# EAGLE schematic FishShield_v2 (EAGLE 7.5.0)
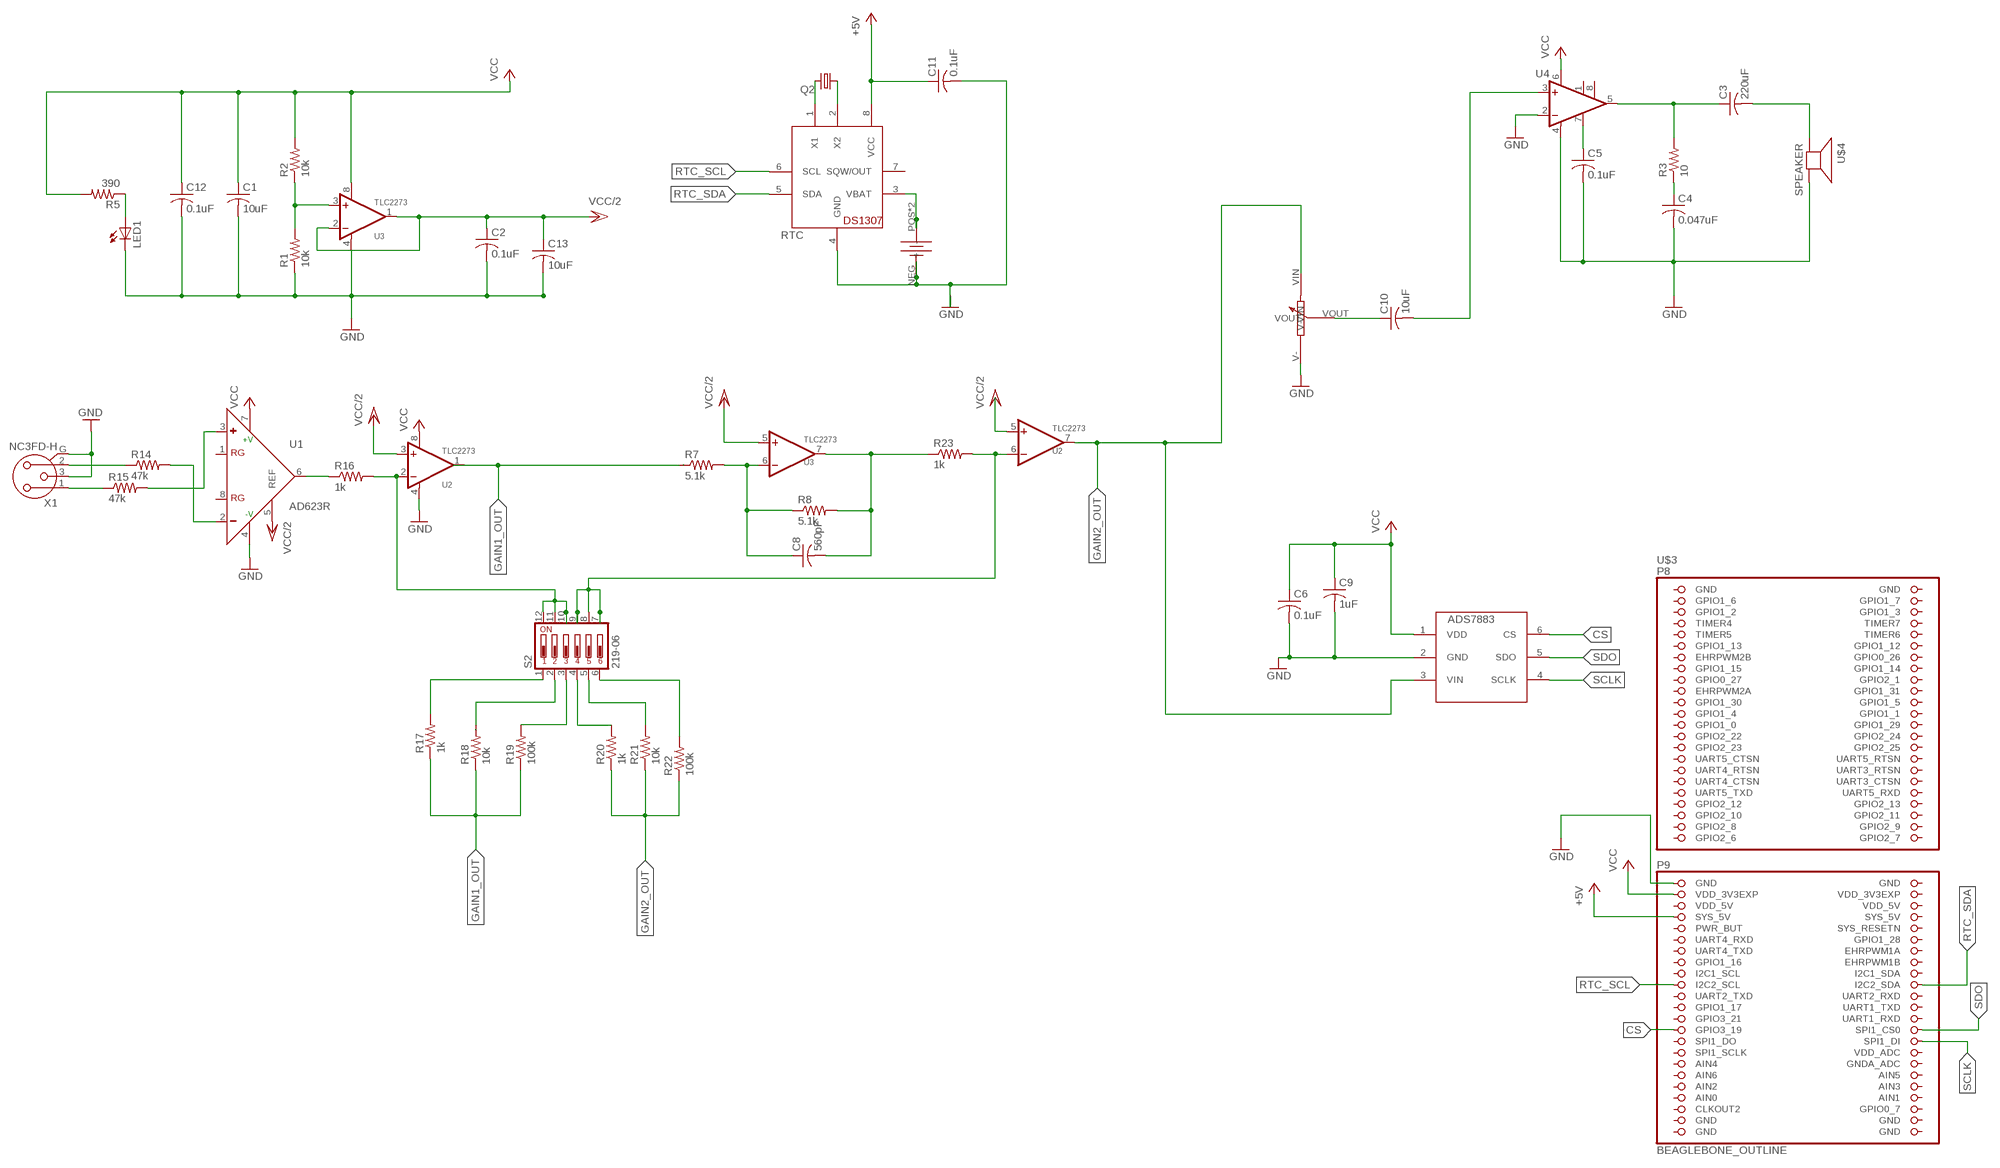
[diagram p0: schematic, sheet 1]

## Parts
ADC  ADS7883  [SOT23-6]
C1  10uF  C-US050-024X044  [C050-024X044]
C2  0.1uF  C-US050-024X044  [C050-024X044]
C3  220uF  C-US050-050X075  [C050-050X075]
C4  0.047uF  C-US050-024X044  [C050-024X044]
C5  0.1uF  C-US050-024X044  [C050-024X044]
C6  0.1uF  C-US050-024X044  [C050-024X044]
C8  560pF  C-US050-024X044  [C050-024X044]
C9  1uF  C-US050-024X044  [C050-024X044]
C10  10uF  C-US050-030X075  [C050-030X075]
C11  0.1uF  C-US050-024X044  [C050-024X044]
C12  0.1uF  C-US050-024X044  [C050-024X044]
C13  10uF  C-US050-024X044  [C050-024X044]
LED1  LEDLSU260  [LSU260]
P1  POT  [10K_POT]
Q2  CRYSTALTC38H  [TC38H]
R1  10k  R-US_0204/2V  [0204V]
R2  10k  R-US_0204/2V  [0204V]
R3  10  R-US_0204/2V  [0204V]
R5  390  R-US_0204/2V  [0204V]
R7  5.1k  R-US_0204/2V  [0204V]
R8  5.1k  R-US_0204/2V  [0204V]
R14  47k  R-US_0204/2V  [0204V]
R15  47k  R-US_0204/2V  [0204V]
R16  1k  R-US_0204/2V  [0204V]
R17  1k  R-US_0204/2V  [0204V]
R18  10k  R-US_0204/2V  [0204V]
R19  100k  R-US_0204/2V  [0204V]
R20  1k  R-US_0204/2V  [0204V]
R21  10k  R-US_0204/2V  [0204V]
R22  100k  R-US_0204/2V  [0204V]
R23  1k  R-US_0204/2V  [0204V]
RTC  DS1307  [DIL08]
S2  219-06  [CTS-219-06]
U1  AD623R  [SO8]
U2  U2  DUAL_OPAMP  [SOIC-8]
U3  U3  DUAL_OPAMP  [SOIC-8]
U4  LM386M-1  [SO08]
U$3  BEAGLEBONE_OUTLINE  [BEAGLEBONE_SHIELD]
U$4  SPEAKER  [SPEAKER]
U$5  BATTERY  [BATTERY]
X1  NC3FD-H  [NC3FD-H]

## Nets
+5V: C11.1 RTC.8(VCC) U$3.53(SYS_5V)
CS: ADC.6(CS) U$3.73(GPIO3_19)
GAIN1: R16.2 S2.10 S2.11 S2.12 U2.2(-IN)
GAIN1_OUT: R7.1 R17.1 R18.1 R19.1
GAIN2: R23.2 S2.7 S2.8 S2.9 U2.6(-IN)
GAIN2_OUT: ADC.3(VIN) P1.VIN R20.1 R21.1 R22.1 U2.7(OUT)
GND: ADC.2(GND) C1.2 C2.2 C4.2 C5.2 C6.2 C9.2 C12.2 C13.2 LED1.K(C) P1.V- R1.1 U1.4(-V) U2.4(V-) U3.4(V-) U4.2(-IN) U4.4(GND) U$3.47(GND) U$4.P$1(-) X1.3 X1.G
N$1: R14.1 X1.2
N$2: R15.2 U1.3(+)
N$3: R14.2 U1.2(-)
N$4: R16.1 U1.6(OUT)
N$5: R1.2 R2.1 U3.3(+IN)
N$6: LED1.A R5.1
N$7: RTC.3(VBAT) U$5.POS2(+) U$5.POS(+)
N$8: C10.1 P1.VOUT
N$9: C8.1 R7.2 R8.1 U3.6(-IN)
N$10: C8.2 R8.2 R23.1 U3.7(OUT)
N$12: U2.5(+IN) ; supply symbol labelled VCC/2
N$13: R20.2 S2.4
N$14: C10.2 U4.3(+IN)
N$15: C5.1 U4.7(BYPASS)
N$16: C3.1 R3.2 U4.5(OUT)
N$18: R17.2 S2.1
N$19: C3.2 U$4.P$2(+)
N$20: R21.2 S2.5
N$21: R22.2 S2.6
N$22: R18.2 S2.2
N$23: R19.2 S2.3
N$24: Q2.1 RTC.2(X2)
N$26: C4.1 R3.1
N$27: Q2.2 RTC.1(X1)
N$28: C11.2 RTC.4(GND) U$5.NEG(-)
R15: R15.1 X1.1
RTC_SCL: RTC.6(SCL) U$3.65(I2C2_SCL)
RTC_SDA: RTC.5(SDA) U$3.66(I2C2_SDA)
SCLK: ADC.4(SCLK) U$3.76(SPI1_DI)
SDO: ADC.5(SDO) U$3.74(SPI1_CS0)
VCC: ADC.1(VDD) C1.1 C6.1 C9.1 C12.1 R2.2 R5.2 U1.7(+V) U2.8(V+) U3.8(V+) U4.6(VS) U$3.49(VDD_3V3EXP)
VCC/2: C2.1 C13.1 U1.5(REF) U2.3(+IN) U3.1(OUT) U3.2(-IN) U3.5(+IN)
Unconnected: RTC.7(SQW/OUT) U1.1(RG) U1.8(RG) U2.1(OUT) U4.1(GAIN) U4.8(GAIN) U$3.3(GPIO1_6) U$3.4(GPIO1_7) U$3.5(GPIO1_2) U$3.6(GPIO1_3) U$3.7(TIMER4) U$3.8(TIMER7) U$3.9(TIMER5) U$3.10(TIMER6) U$3.11(GPIO1_13) U$3.12(GPIO1_12) U$3.13(EHRPWM2B) U$3.14(GPIO0_26) U$3.15(GPIO1_15) U$3.16(GPIO1_14) U$3.17(GPIO0_27) U$3.18(GPIO2_1) U$3.19(EHRPWM2A) U$3.20(GPIO1_31) U$3.21(GPIO1_30) U$3.22(GPIO1_5) U$3.23(GPIO1_4) U$3.24(GPIO1_1) U$3.25(GPIO1_0) U$3.26(GPIO1_29) U$3.27(GPIO2_22) U$3.28(GPIO2_24) U$3.29(GPIO2_23) U$3.30(GPIO2_25) U$3.31(UART5_CTSN) U$3.32(UART5_RTSN) U$3.33(UART4_RTSN) U$3.34(UART3_RTSN) U$3.35(UART4_CTSN) U$3.36(UART3_CTSN) U$3.37(UART5_TXD) U$3.38(UART5_RXD) U$3.39(GPIO2_12) U$3.40(GPIO2_13) U$3.41(GPIO2_10) U$3.42(GPIO2_11) U$3.43(GPIO2_8) U$3.44(GPIO2_9) U$3.45(GPIO2_6) U$3.46(GPIO2_7) U$3.54(SYS_5V) U$3.55(PWR_BUT) U$3.56(SYS_RESETN) U$3.57(UART4_RXD) U$3.58(GPIO1_28) U$3.59(UART4_TXD) U$3.60(EHRPWM1A) U$3.61(GPIO1_16) U$3.62(EHRPWM1B) U$3.63(I2C1_SCL) U$3.64(I2C1_SDA) U$3.67(UART2_TXD) U$3.68(UART2_RXD) U$3.69(GPIO1_17) U$3.70(UART1_TXD) U$3.71(GPIO3_21) U$3.72(UART1_RXD) U$3.75(SPI1_DO) U$3.77(SPI1_SCLK) U$3.78(VDD_ADC) U$3.79(AIN4) U$3.80(GNDA_ADC) U$3.81(AIN6) U$3.82(AIN5) U$3.83(AIN2) U$3.84(AIN3) U$3.86(AIN1) U$3.87(CLKOUT2) U$3.88(GPIO0_7)

## Power pins joined to a net without a drawn wire
AIN0: U$3.85(AIN0)
GND: U$3.1(GND) U$3.2(GND) U$3.48(GND) U$3.89(GND) U$3.90(GND) U$3.91(GND) U$3.92(GND)
VDD_3V3EXP: U$3.50(VDD_3V3EXP)
VDD_5V: U$3.51(VDD_5V) U$3.52(VDD_5V)

## Library data of the parts
ADC = Personal:ADS7883
C1-C6 C8-C13 = Personal:C-US: CAPACITOR, American symbol
LED1 = adafruit:LED: LED OSRAM: - CHIPLED LG R971, LG N971, LY N971, LG Q971, LY Q971, LO R971, LY R971 LH N974, LH R974 LS Q976, LO Q976, LY Q976 LO Q996 - Hyper CHIPLED LW Q18S LB Q993, LB Q99A, LB R99A - SideLED LS A670, LO A670, LY A670, LG A670, LP A670 LB A673, LV A673, LT A673, LW A673 LH A674 LY A675 LS A676, LA A676, LO A676, LY A676, LW A676 LS A679, LY A679, LG A679 - Hyper Micro SIDELED® LS Y876, LA Y876, LO Y876, LY Y876 LT Y87S - SmartLED LW L88C, LW L88S LB L89C, LB L89S, LG L890 LS L89K, LO L89K, LY L89K LS L896, LA L896, LO L896, LY L896 - TOPLED LS T670, LO T670, LY T670, LG T670, LP T670 LSG T670, LSP T670, LSY T670, LOP T670, LYG T670 LG T671, LOG T671, LSG T671 LB T673, LV T673, LT T673, LW T673 LH T674 LS T676, LA T676, LO T676, LY T676, LB T676, LH T676, LSB T676, LW T676 LB T67C, LV T67C, LT T67C, LS T67K, LO T67K, LY T67K, LW E67C LS E67B, LA E67B, LO E67B, LY E67B, LB E67C, LV E67C, LT E67C LW T67C LS T679, LY T679, LG T679 LS T770, LO T770, LY T770, LG T770, LP T770 LB T773, LV T773, LT T773, LW T773 LH T774 LS E675, LA E675, LY E675, LS T675 LS T776, LA T776, LO T776, LY T776, LB T776 LHGB T686 LT T68C, LB T68C - Hyper Mini TOPLED® LB M676 - Mini TOPLED Santana® LG M470 LS M47K, LO M47K, LY M47K Source: http://www.osram.convergy.de/
P1 = Personal:POT: POTENTIOMENTER
Q2 = adafruit:CRYSTAL: CRYSTAL; OC_FARNELL: unknown; OC_NEWARK: unknown
R1-R3 R5 R7 R8 R14-R23 = resistor:R-US_: RESISTOR, American symbol
RTC = adafruit:DS1307: DS1307 Real time clock (RTC) with battery backup ability. Talk to it via i2c
S2 = Personal:219-06*: Surface Mount DIP Switch Series 219 SMT CTS Electronic Components Sourc: www.ctscorp.com; OC_FARNELL: unknown; OC_NEWARK: unknown
U1 = analog-devices:AD623: Single-Supply, Rail-to-Rail, Low Cost Instrumentation Amplifier Source: http://www.analog.com/static/imported-files/data_sheets/AD623.pdf; MPN: AD623ARZ.; OC_FARNELL: 9426213; OC_NEWARK: 31M4186
U2 U3 = Personal:DUAL_OPAMP
U4 = linear:LM386?-*: Low Voltage Audio Power Amplifier Source: http://cache.national.com/ds/LM/LM386.pdf
U$3 = adafruit:BEAGLEBONE_OUTLINE: Should match A3 pinout - but not completely tested
U$4 = Personal:SPEAKER
U$5 = Personal:BATTERY
X1 = con-neutrik_ag:NC3: Neutrik Audio Connector XLR SERIES Stereo 1/4" jack Source: www.neutrik.com/; MF: NEUTRIK; MPN: NC3FD-H; OC_FARNELL: 1608398; OC_NEWARK: 87F6600